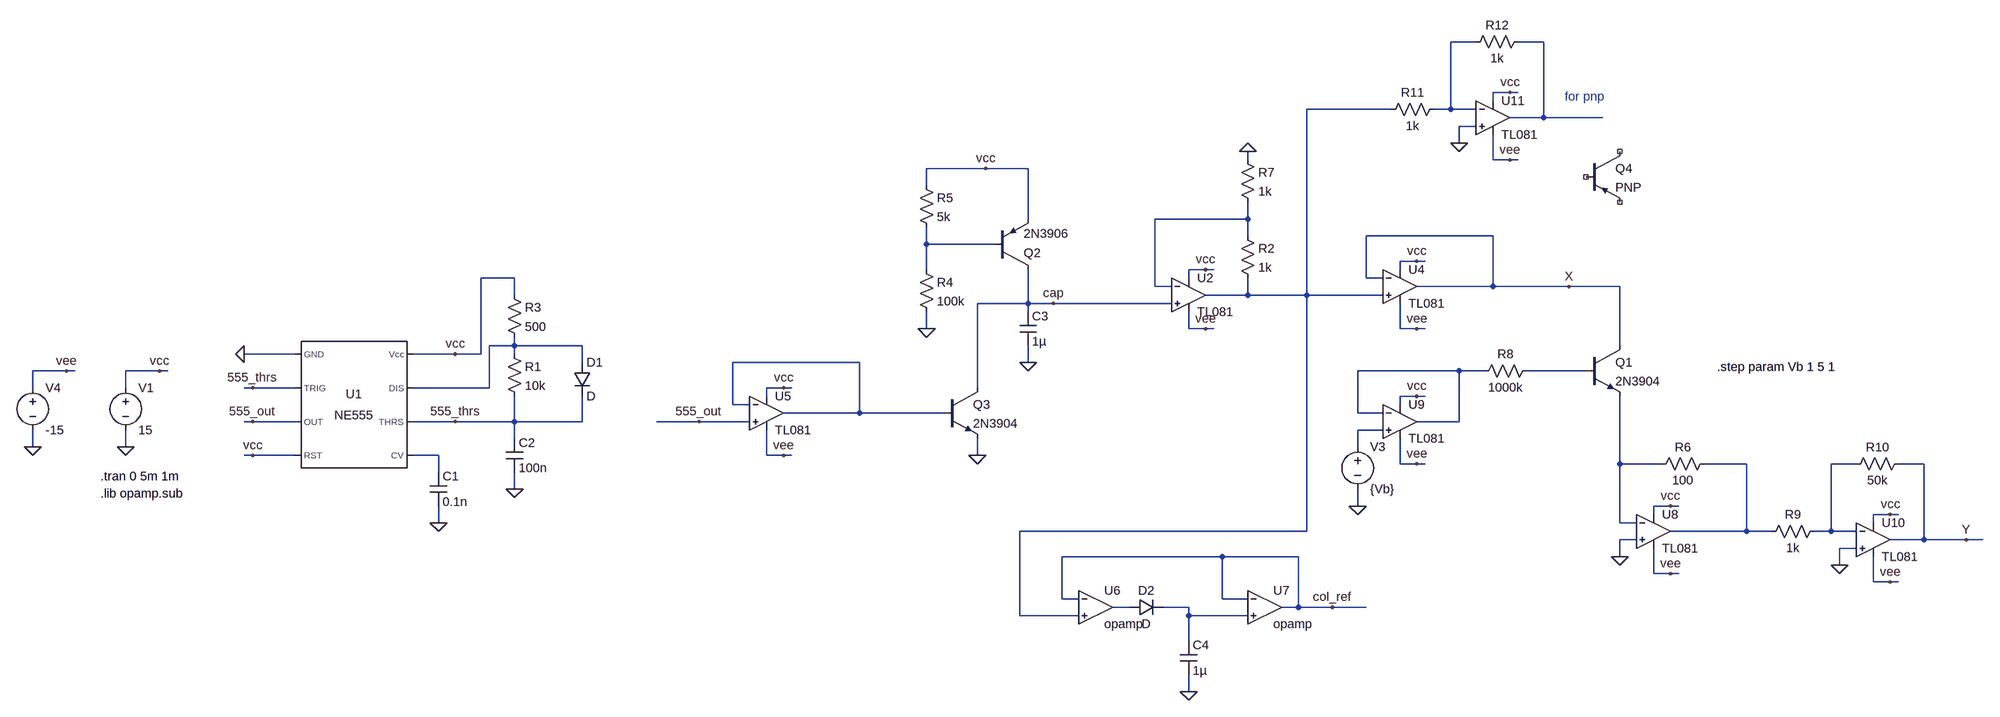
[diagram p0: schematic curvetrace.asc]
curvetrace.asc, the LTspice schematic file:
Version 4
SHEET 1 5284 1044
WIRE 3984 -208 3936 -208
WIRE 4112 -208 4064 -208
WIRE 4048 -112 4016 -112
WIRE 4064 -112 4048 -112
WIRE 4016 -96 4016 -112
WIRE 3824 -80 3664 -80
WIRE 3936 -80 3936 -208
WIRE 3936 -80 3904 -80
WIRE 3984 -80 3936 -80
WIRE 4112 -64 4112 -208
WIRE 4112 -64 4048 -64
WIRE 4224 -64 4112 -64
WIRE 3984 -48 3952 -48
WIRE 3952 -16 3952 -48
WIRE 3552 16 3552 0
WIRE 4016 16 4016 -32
WIRE 4048 16 4016 16
WIRE 4064 16 4048 16
WIRE 3056 32 2944 32
WIRE 3136 32 3056 32
WIRE 2944 64 2944 32
WIRE 3136 128 3136 32
WIRE 3552 128 3552 96
WIRE 3552 128 3376 128
WIRE 3552 160 3552 128
WIRE 4016 160 3776 160
WIRE 2944 176 2944 144
WIRE 3072 176 2944 176
WIRE 3872 208 3840 208
WIRE 3888 208 3872 208
WIRE 2944 224 2944 176
WIRE 3472 224 3440 224
WIRE 3488 224 3472 224
WIRE 3840 224 3840 208
WIRE 1664 240 1600 240
WIRE 3440 240 3440 224
WIRE 3776 240 3776 160
WIRE 3808 240 3776 240
WIRE 3376 256 3376 128
WIRE 3408 256 3376 256
WIRE 4016 256 4016 160
WIRE 4016 256 3872 256
WIRE 4160 256 4016 256
WIRE 4256 256 4160 256
WIRE 1664 272 1664 240
WIRE 3552 272 3552 240
WIRE 3552 272 3472 272
WIRE 3664 272 3664 -80
WIRE 3664 272 3552 272
WIRE 3808 272 3664 272
WIRE 3136 288 3136 224
WIRE 3136 288 3040 288
WIRE 3184 288 3136 288
WIRE 3408 288 3184 288
WIRE 3136 304 3136 288
WIRE 2944 336 2944 304
WIRE 3440 336 3440 304
WIRE 3472 336 3440 336
WIRE 3488 336 3472 336
WIRE 3840 336 3840 288
WIRE 3872 336 3840 336
WIRE 3888 336 3872 336
WIRE 1664 368 1664 352
WIRE 1664 368 1616 368
WIRE 1792 368 1664 368
WIRE 4256 368 4256 256
WIRE 1248 384 1152 384
WIRE 1552 384 1472 384
WIRE 1600 384 1600 240
WIRE 1600 384 1552 384
WIRE 1664 384 1664 368
WIRE 1792 400 1792 368
WIRE 2592 400 2352 400
WIRE 3136 400 3136 368
WIRE 816 416 752 416
WIRE 832 416 816 416
WIRE 992 416 928 416
WIRE 1008 416 992 416
WIRE 3952 416 3760 416
WIRE 4000 416 3952 416
WIRE 4192 416 4080 416
WIRE 752 448 752 416
WIRE 928 448 928 416
WIRE 1168 448 1152 448
WIRE 1248 448 1168 448
WIRE 1616 448 1616 368
WIRE 1616 448 1472 448
WIRE 2448 448 2416 448
WIRE 2464 448 2448 448
WIRE 3040 448 3040 288
WIRE 2416 464 2416 448
WIRE 3872 464 3840 464
WIRE 3888 464 3872 464
WIRE 2352 480 2352 400
WIRE 2384 480 2352 480
WIRE 3840 480 3840 464
WIRE 2592 496 2592 400
WIRE 2592 496 2448 496
WIRE 2976 496 2592 496
WIRE 3760 496 3760 416
WIRE 3808 496 3760 496
WIRE 1168 512 1152 512
WIRE 1248 512 1168 512
WIRE 1552 512 1472 512
WIRE 1664 512 1664 464
WIRE 1664 512 1552 512
WIRE 1792 512 1792 464
WIRE 1792 512 1664 512
WIRE 2288 512 2208 512
WIRE 2384 512 2288 512
WIRE 3952 512 3952 416
WIRE 3952 512 3872 512
WIRE 3808 528 3760 528
WIRE 1664 544 1664 512
WIRE 752 560 752 528
WIRE 928 560 928 528
WIRE 3760 560 3760 528
WIRE 1168 576 1152 576
WIRE 1248 576 1168 576
WIRE 1520 576 1472 576
WIRE 2416 576 2416 528
WIRE 2448 576 2416 576
WIRE 2464 576 2448 576
WIRE 3040 576 3040 544
WIRE 3840 592 3840 544
WIRE 3872 592 3840 592
WIRE 3888 592 3872 592
WIRE 4256 592 4256 464
WIRE 4336 592 4256 592
WIRE 4496 592 4416 592
WIRE 4704 592 4656 592
WIRE 4832 592 4784 592
WIRE 1520 608 1520 576
WIRE 1664 640 1664 608
WIRE 3760 672 3760 640
WIRE 4352 672 4320 672
WIRE 4368 672 4352 672
WIRE 4320 688 4320 672
WIRE 4768 688 4736 688
WIRE 4784 688 4768 688
WIRE 1520 704 1520 672
WIRE 4256 704 4256 592
WIRE 4288 704 4256 704
WIRE 4736 704 4736 688
WIRE 3664 720 3664 272
WIRE 3664 720 3120 720
WIRE 4496 720 4496 592
WIRE 4496 720 4352 720
WIRE 4544 720 4496 720
WIRE 4656 720 4656 592
WIRE 4656 720 4624 720
WIRE 4704 720 4656 720
WIRE 4288 736 4256 736
WIRE 4832 736 4832 592
WIRE 4832 736 4768 736
WIRE 4912 736 4832 736
WIRE 4944 736 4912 736
WIRE 4704 752 4672 752
WIRE 3504 768 3200 768
WIRE 3648 768 3504 768
WIRE 4256 768 4256 736
WIRE 4672 784 4672 752
WIRE 4320 800 4320 752
WIRE 4352 800 4320 800
WIRE 4368 800 4352 800
WIRE 4736 816 4736 768
WIRE 4768 816 4736 816
WIRE 4784 816 4768 816
WIRE 3200 848 3200 768
WIRE 3232 848 3200 848
WIRE 3504 848 3504 768
WIRE 3552 848 3504 848
WIRE 3328 864 3296 864
WIRE 3440 864 3392 864
WIRE 3648 864 3648 768
WIRE 3648 864 3616 864
WIRE 3712 864 3648 864
WIRE 3776 864 3712 864
WIRE 3120 880 3120 720
WIRE 3232 880 3120 880
WIRE 3440 880 3440 864
WIRE 3552 880 3440 880
WIRE 3440 928 3440 880
WIRE 3440 1024 3440 992
FLAG 928 560 0
FLAG 992 416 vcc
FLAG 1552 384 vcc
FLAG 1168 576 vcc
FLAG 1168 448 555_thrs
FLAG 1552 512 555_thrs
FLAG 1152 384 0
FLAG 1168 512 555_out
FLAG 1520 704 0
FLAG 3136 400 0
FLAG 2944 336 0
FLAG 3056 32 vcc
FLAG 3040 576 0
FLAG 1664 640 0
FLAG 2288 512 555_out
FLAG 3440 1024 0
FLAG 3472 224 vcc
FLAG 3552 0 0
FLAG 3712 864 col_ref
FLAG 3872 208 vcc
FLAG 3184 288 cap
FLAG 3760 672 0
FLAG 752 560 0
FLAG 816 416 vee
FLAG 3472 336 vee
FLAG 3872 336 vee
FLAG 2448 448 vcc
FLAG 2448 576 vee
FLAG 4352 672 vcc
FLAG 4352 800 vee
FLAG 4256 768 0
FLAG 3872 464 vcc
FLAG 3872 592 vee
FLAG 4160 256 X
FLAG 4912 736 Y
FLAG 4768 688 vcc
FLAG 4768 816 vee
FLAG 4672 784 0
FLAG 4048 -112 vcc
FLAG 4048 16 vee
FLAG 3952 -16 0
SYMBOL voltage 928 432 R0
WINDOW 123 0 0 Left 0
WINDOW 39 0 0 Left 0
SYMATTR InstName V1
SYMATTR Value 15
SYMBOL Misc\\NE555 1360 480 R0
SYMATTR InstName U1
SYMBOL cap 1504 608 R0
SYMATTR InstName C1
SYMATTR Value 0.1n
SYMBOL pnp 3072 224 M180
SYMATTR InstName Q2
SYMATTR Value 2N3906
SYMBOL res 2928 208 R0
SYMATTR InstName R4
SYMATTR Value 100k
SYMBOL res 2928 48 R0
SYMATTR InstName R5
SYMATTR Value 5k
SYMBOL cap 3120 304 R0
SYMATTR InstName C3
SYMATTR Value 1µ
SYMBOL npn 2976 448 R0
SYMATTR InstName Q3
SYMATTR Value 2N3904
SYMBOL res 1648 368 R0
SYMATTR InstName R1
SYMATTR Value 10k
SYMBOL cap 1648 544 R0
SYMATTR InstName C2
SYMATTR Value 100n
SYMBOL res 1648 256 R0
SYMATTR InstName R3
SYMATTR Value 500
SYMBOL diode 1776 400 R0
SYMATTR InstName D1
SYMBOL OpAmps\\opamp 3264 800 R0
SYMATTR InstName U6
SYMBOL OpAmps\\opamp 3584 800 R0
SYMATTR InstName U7
SYMBOL diode 3328 880 R270
WINDOW 0 32 32 VTop 2
WINDOW 3 0 32 VBottom 2
SYMATTR InstName D2
SYMBOL cap 3424 928 R0
SYMATTR InstName C4
SYMATTR Value 1µ
SYMBOL res 3536 144 R0
SYMATTR InstName R2
SYMATTR Value 1k
SYMBOL res 3536 0 R0
SYMATTR InstName R7
SYMATTR Value 1k
SYMBOL npn 4192 368 R0
SYMATTR InstName Q1
SYMATTR Value 2N3904
SYMBOL voltage 3760 544 R0
WINDOW 123 0 0 Left 0
WINDOW 39 0 0 Left 0
SYMATTR InstName V3
SYMATTR Value {Vb}
SYMBOL voltage 752 432 R0
WINDOW 123 0 0 Left 0
WINDOW 39 0 0 Left 0
SYMATTR InstName V4
SYMATTR Value -15
SYMBOL AutoGenerated\\TL081 3440 272 R0
SYMATTR InstName U2
SYMBOL AutoGenerated\\TL081 3840 256 R0
SYMATTR InstName U4
SYMBOL AutoGenerated\\TL081 2416 496 R0
SYMATTR InstName U5
SYMBOL AutoGenerated\\TL081 4320 720 R0
SYMATTR InstName U8
SYMBOL res 4432 576 R90
WINDOW 0 0 56 VBottom 2
WINDOW 3 32 56 VTop 2
SYMATTR InstName R6
SYMATTR Value 100
SYMBOL AutoGenerated\\TL081 3840 512 R0
SYMATTR InstName U9
SYMBOL res 4096 400 R90
WINDOW 0 0 56 VBottom 2
WINDOW 3 32 56 VTop 2
SYMATTR InstName R8
SYMATTR Value 1000k
SYMBOL AutoGenerated\\TL081 4736 736 R0
SYMATTR InstName U10
SYMBOL res 4640 704 R90
WINDOW 0 0 56 VBottom 2
WINDOW 3 32 56 VTop 2
SYMATTR InstName R9
SYMATTR Value 1k
SYMBOL res 4800 576 R90
WINDOW 0 0 56 VBottom 2
WINDOW 3 32 56 VTop 2
SYMATTR InstName R10
SYMATTR Value 50k
SYMBOL AutoGenerated\\TL081 4016 -64 R0
SYMATTR InstName U11
SYMBOL res 3920 -96 R90
WINDOW 0 0 56 VBottom 2
WINDOW 3 32 56 VTop 2
SYMATTR InstName R11
SYMATTR Value 1k
SYMBOL res 4080 -224 R90
WINDOW 0 0 56 VBottom 2
WINDOW 3 32 56 VTop 2
SYMATTR InstName R12
SYMATTR Value 1k
SYMBOL pnp 4192 0 R0
SYMATTR InstName Q4
TEXT 880 616 Left 2 !.tran 0 5m 1m
TEXT 880 648 Left 2 !.lib opamp.sub
TEXT 4440 408 Left 2 !.step param Vb 1 5 1
TEXT 4152 -104 Left 2 ;for pnp

The netlist it stands for:
* curvetrace.asc
V1 vcc 0 15
XU1 0 555_thrs 555_out vcc N011 555_thrs N006 vcc NE555  ; pins GND TRIG OUT RST CV THRS DIS Vcc
C1 N011 0 0.1n
Q2 cap N005 vcc 0 2N3906
R4 N005 0 100k
R5 vcc N005 5k
C3 cap 0 1µ
Q3 cap N007 0 0 2N3904
R1 N006 555_thrs 10k
C2 555_thrs 0 100n
R3 vcc N006 500
D1 N006 555_thrs D
XU6 col_ref N003 N015 opamp Aol=100K GBW=10Meg  ; pins invin noninvin out
XU7 col_ref N016 col_ref opamp Aol=100K GBW=10Meg  ; pins invin noninvin out
D2 N015 N016 D
C4 N016 0 1µ
R2 N004 N003 1k
R7 0 N004 1k
Q1 X N009 N012 0 2N3904
V3 N010 0 {Vb}
V4 vee 0 -15
* U2: TL081 (symbol AutoGenerated\TL081 not available, pins judged from their places): In+=cap In-=N004 V+=vcc V-=vee OUT=N003
* U4: TL081 (symbol AutoGenerated\TL081 not available, pins judged from their places): In+=N003 In-=X V+=vcc V-=vee OUT=X
* U5: TL081 (symbol AutoGenerated\TL081 not available, pins judged from their places): In+=555_out In-=N007 V+=vcc V-=vee OUT=N007
* U8: TL081 (symbol AutoGenerated\TL081 not available, pins judged from their places): In+=0 In-=N012 V+=vcc V-=vee OUT=N013
R6 N013 N012 100
* U9: TL081 (symbol AutoGenerated\TL081 not available, pins judged from their places): In+=N010 In-=N008 V+=vcc V-=vee OUT=N008
R8 N009 N008 1000k
* U10: TL081 (symbol AutoGenerated\TL081 not available, pins judged from their places): In+=0 In-=N014 V+=vcc V-=vee OUT=Y
R9 N014 N013 1k
R10 Y N014 50k
* U11: TL081 (symbol AutoGenerated\TL081 not available, pins judged from their places): In+=0 In-=N001 V+=vcc V-=vee OUT=N002
R11 N001 N003 1k
R12 N002 N001 1k
Q4 NC_01 NC_02 NC_03 0 PNP
.model D D
.lib standard.dio
.model NPN NPN
.model PNP PNP
.lib standard.bjt
.tran 0 5m 1m
.lib opamp.sub
.step param Vb 1 5 1
* for pnp
.lib NE555.sub
.backanno
.end